# EAGLE design A32_to_Samtec50mil (EAGLE 8.6.1)
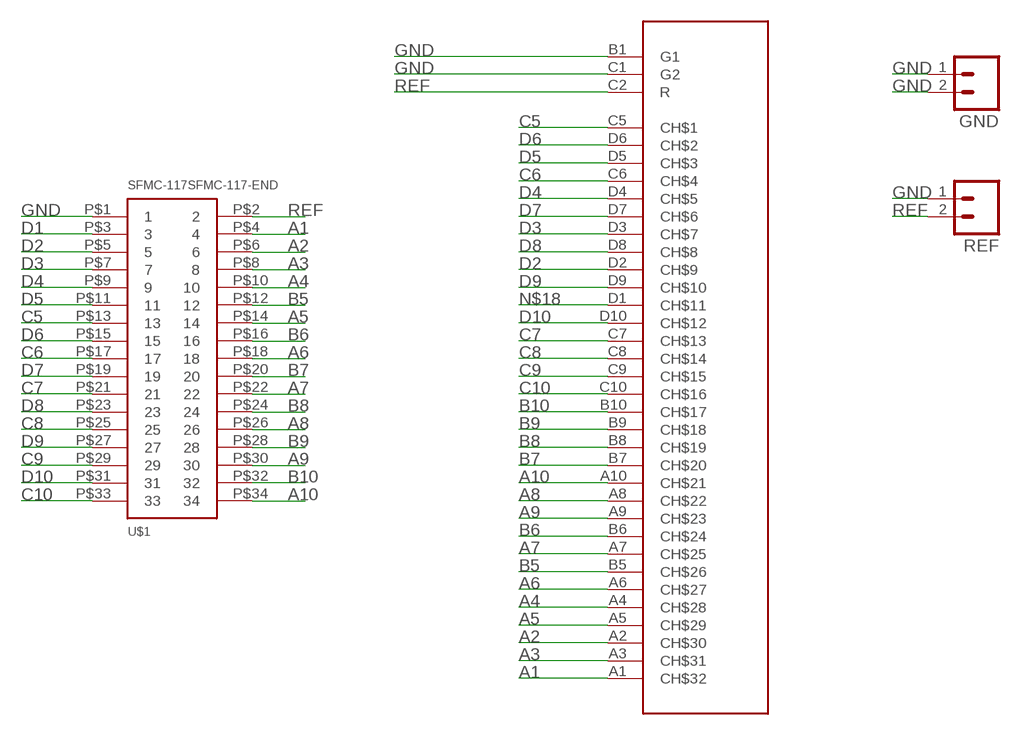
[diagram p0: schematic, sheet 1]

## Parts
GND  M02PTH  [1X02]
REF  M02PTH  [1X02]
U$1  SFMC-117SFMC-117-END  [SFMC-117-END]
U$2  NEURONEXUS-A32  [ROLC-110-XX-XX-Q-LC]

## Nets
A1: U$1.P$4 U$2.A1(CH$32)
A2: U$1.P$6 U$2.A2(CH$30)
A3: U$1.P$8 U$2.A3(CH$31)
A4: U$1.P$10 U$2.A4(CH$28)
A5: U$1.P$14 U$2.A5(CH$29)
A6: U$1.P$18 U$2.A6(CH$27)
A7: U$1.P$22 U$2.A7(CH$25)
A8: U$1.P$26 U$2.A8(CH$22)
A9: U$1.P$30 U$2.A9(CH$23)
A10: U$1.P$34 U$2.A10(CH$21)
B5: U$1.P$12 U$2.B5(CH$26)
B6: U$1.P$16 U$2.B6(CH$24)
B7: U$1.P$20 U$2.B7(CH$20)
B8: U$1.P$24 U$2.B8(CH$19)
B9: U$1.P$28 U$2.B9(CH$18)
B10: U$1.P$32 U$2.B10(CH$17)
C5: U$1.P$13 U$2.C5(CH$1)
C6: U$1.P$17 U$2.C6(CH$4)
C7: U$1.P$21 U$2.C7(CH$13)
C8: U$1.P$25 U$2.C8(CH$14)
C9: U$1.P$29 U$2.C9(CH$15)
C10: U$1.P$33 U$2.C10(CH$16)
D1: U$1.P$3
D2: U$1.P$5 U$2.D2(CH$9)
D3: U$1.P$7 U$2.D3(CH$7)
D4: U$1.P$9 U$2.D4(CH$5)
D5: U$1.P$11 U$2.D5(CH$3)
D6: U$1.P$15 U$2.D6(CH$2)
D7: U$1.P$19 U$2.D7(CH$6)
D8: U$1.P$23 U$2.D8(CH$8)
D9: U$1.P$27 U$2.D9(CH$10)
D10: U$1.P$31 U$2.D10(CH$12)
GND: GND.1 GND.2 REF.1 U$1.P$1 U$2.B1(G1) U$2.C1(G2)
N$18: U$2.D1(CH$11)
REF: REF.2 U$1.P$2 U$2.C2(R)

## Library data of the parts
GND REF = SparkFun:M02: Header 2 Standard 2-pin 0.1" header. Use with straight break away headers (SKU : PRT-00116), right angle break away headers (PRT-00553), swiss pins (PRT-00743), machine pins (PRT-00117), and female headers (PRT-00115). Molex polarized connector foot print use with SKU : PRT-08233 with associated crimp pins and housings.
U$1 = UsefulConnectors:SFMC-117
U$2 = UsefulConnectors:NEURONEXUS-A32

## Board
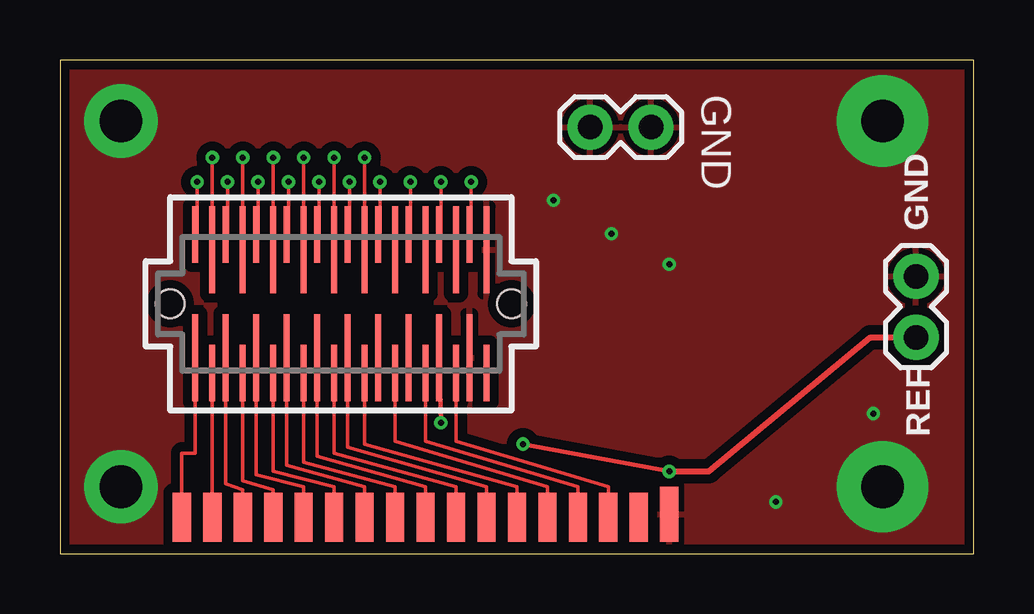
[diagram p1: board, top side]
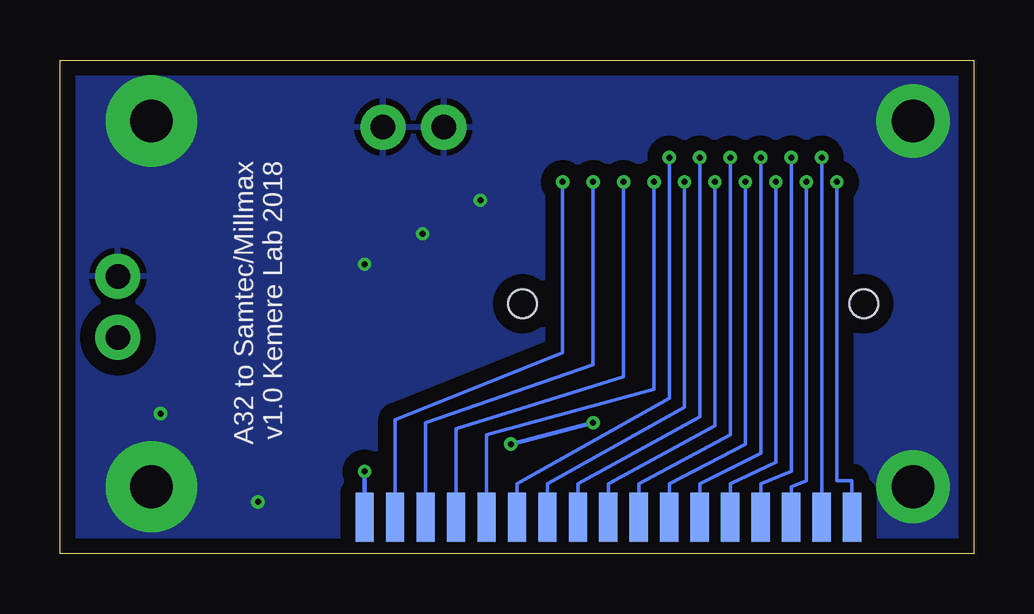
[diagram p2: board, bottom side, seen from below]

Size 38.1 x 20.57 mm. Coordinates in mm from the lower left corner, seen from the top.
Outline: 0,0 38.1,0 38.1,20.57 0,20.57 0,0
Copper layers (1*16): Top 0.035mm / dielectric 1.5mm / Bottom 0.035mm
Design rules "default *": minimum track width 5mil, minimum drill 0.25mm, track to track 5mil, track to pad 5mil, pad to pad 5mil, via to via 11mil, smd to smd 5mil, copper to edge 0.3mm, drill to drill 12mil, minimum pad ring 6mil, minimum via ring 6mil, stop-mask expansion 4mil, vias tented up to drill 0mil, thermal gap 10mil

### Footprints (pad centres in the part's own frame; a part is rotated, then mirrored left to right if it is on the bottom)
1X02 = drill 1.016 pad 1.88: 1 0,0; 2 2.54,0
SFMC-117-END = smd 0.762 x 2.286: P$1 -10.16,-0.127 | smd 0.762 x 2.032 bottom: P$2 -10.16,0; P$4 -8.89,0; P$6 -7.62,0; P$8 -6.35,0; P$10 -5.08,0; P$12 -3.81,0; P$14 -2.54,0; P$16 -1.27,0; P$18 0,0; P$20 1.27,0; P$22 2.54,0; P$24 3.81,0; P$26 5.08,0; P$28 6.35,0; P$30 7.62,0; P$32 8.89,0; P$34 10.16,0 | smd 0.762 x 2.032: P$3 -8.89,0; P$5 -7.62,0; P$7 -6.35,0; P$9 -5.08,0; P$11 -3.81,0; P$13 -2.54,0; P$15 -1.27,0; P$17 0,0; P$19 1.27,0; P$21 2.54,0; P$23 3.81,0; P$25 5.08,0; P$27 6.35,0; P$29 7.62,0; P$31 8.89,0; P$33 10.16,0
ROLC-110-XX-XX-Q-LC = smd 0.254 x 2.362: A1 5.639,2.883; A2 4.369,2.883; A3 3.099,2.883; A4 1.829,2.883; A5 0.559,2.883; A6 -0.711,2.883; A7 -1.981,2.883; A8 -3.251,2.883; A9 -4.521,2.883; A10 -5.791,2.883; D1 6.35,-2.883; D2 5.08,-2.883; D3 3.81,-2.883; D4 2.54,-2.883; D5 1.27,-2.883; D6 0,-2.883; D7 -1.27,-2.883; D8 -2.54,-2.883; D9 -3.81,-2.883; D10 -5.08,-2.883 | smd 0.254 x 3.632: B1 6.35,2.248; B2 5.08,2.248; B3 3.81,2.248; B4 2.54,2.248; B5 1.27,2.248; B6 0,2.248; B7 -1.27,2.248; B8 -2.54,2.248; B9 -3.81,2.248; B10 -5.08,2.248; C1 5.639,-2.248; C2 4.369,-2.248; C3 3.099,-2.248; C4 1.829,-2.248; C5 0.559,-2.248; C6 -0.711,-2.248; C7 -1.981,-2.248; C8 -3.251,-2.248; C9 -4.521,-2.248; C10 -5.791,-2.248 | hole 1.194: 7.391,0; -6.833,0

### Placement (x,y rotation side)
GND  22.1,17.78 0 top
REF  35.69,11.56 270 top
U$1  15.24,1.52 180 top
U$2  11.43,10.41 0 top

### Tracks (layer width: path | path; a pad name or v marks a point on that pad's centre or on a via)
A1  (via drill 0.25)
  Top 0.152: v17.14,15.49 17.14,13.3 U$2.A1
  Bottom 0.152: U$1.P$4 24.13,5.59 17.14,8.38 v17.14,15.49
A2  (via drill 0.25)
  Top 0.152: v15.88,15.49 15.88,13.3 U$2.A2
  Bottom 0.152: U$1.P$6 22.86,5.46 15.88,7.87 v15.88,15.49
A3  (via drill 0.25)
  Top 0.152: v14.61,15.49 14.61,13.3 U$2.A3
  Bottom 0.152: U$1.P$8 21.59,5.21 14.61,7.37 v14.61,15.49
A4  (via drill 0.25)
  Top 0.152: v13.34,15.49 13.34,13.3 U$2.A4
  Bottom 0.152: U$1.P$10 20.32,4.95 13.34,6.86 v13.34,15.49
A5  (via drill 0.25)
  Top 0.152: v12.06,15.49 12.06,13.3 U$2.A5
  Bottom 0.152: U$1.P$14 17.78,2.92 12.06,6.1 v12.06,15.49
A6  (via drill 0.25)
  Top 0.152: v10.79,15.49 10.79,13.3 U$2.A6
  Bottom 0.152: U$1.P$18 15.24,2.92 10.79,5.33 v10.79,15.49
A7  (via drill 0.25)
  Top 0.152: v9.53,15.49 9.53,13.3 U$2.A7
  Bottom 0.152: U$1.P$22 12.7,2.92 9.53,4.57 v9.53,15.49
A8  (via drill 0.25)
  Top 0.152: v8.26,15.49 8.26,13.3 U$2.A8
  Bottom 0.152: U$1.P$26 10.16,2.92 8.26,3.81 v8.26,15.49
A9  (via drill 0.25)
  Top 0.152: v6.99,15.49 6.99,13.3 U$2.A9
  Bottom 0.152: U$1.P$30 7.62,2.79 6.99,3.05 v6.99,15.49
A10  (via drill 0.25)
  Top 0.152: v5.71,15.49 5.71,13.3 U$2.A10
  Bottom 0.152: U$1.P$34 5.08,3.05 5.71,3.05 v5.71,15.49
B5  (via drill 0.25)
  Top 0.152: v12.7,16.51 U$2.B5
  Bottom 0.152: U$1.P$12 19.05,2.92 12.7,6.48 v12.7,16.51
B6  (via drill 0.25)
  Top 0.152: v11.43,16.51 U$2.B6
  Bottom 0.152: U$1.P$16 16.51,2.92 11.43,5.71 v11.43,16.51
B7  (via drill 0.25)
  Top 0.152: v10.16,16.51 U$2.B7
  Bottom 0.152: U$1.P$20 13.97,2.92 10.16,4.95 v10.16,16.51
B8  (via drill 0.25)
  Top 0.152: v8.89,16.51 U$2.B8
  Bottom 0.152: U$1.P$24 11.43,2.92 8.89,4.19 v8.89,16.51
B9  (via drill 0.25)
  Top 0.152: U$2.B9 v7.62,16.51
  Bottom 0.152: v7.62,16.51 7.62,3.43 8.89,2.92 U$1.P$28
B10  (via drill 0.25)
  Top 0.152: v6.35,16.51 U$2.B10
  Bottom 0.152: U$1.P$32 v6.35,16.51
C5
  Top 0.152: U$2.C5 11.99,4.45 17.78,2.79 U$1.P$13
C6
  Top 0.152: U$2.C6 10.72,4.06 15.24,2.79 U$1.P$17
C7
  Top 0.152: U$2.C7 9.45,3.68 12.7,2.79 U$1.P$21
C8
  Top 0.152: U$2.C8 8.18,3.3 10.16,2.79 U$1.P$25
C9
  Top 0.152: U$1.P$29 7.62,2.67 6.91,2.92 U$2.C9
C10
  Top 0.152: U$2.C10 5.64,4.19 5.08,4.19 U$1.P$33
D2
  Top 0.152: U$2.D2 16.51,4.7 22.86,2.79 U$1.P$5
D3
  Top 0.152: U$2.D3 15.24,4.7 21.59,2.79 U$1.P$7
D4
  Top 0.152: U$2.D4 13.97,4.7 20.32,2.79 U$1.P$9
D5
  Top 0.152: U$2.D5 12.7,4.57 19.05,2.79 U$1.P$11
D6
  Top 0.152: U$2.D6 11.43,4.19 16.51,2.79 U$1.P$15
D7
  Top 0.152: U$2.D7 10.16,3.81 13.97,2.79 U$1.P$19
D8
  Top 0.152: U$2.D8 8.89,3.43 11.43,2.79 U$1.P$23
D9
  Top 0.152: U$2.D9 7.62,3.05 8.89,2.67 U$1.P$27
D10
  Top 0.152: U$1.P$31 U$2.D10
GND  (via drill 0.25, 1.78 pad 3.05, 1.78 pad 3.81)
  Top 0.254: U$2.B1 17.78,11.43
  other vias: 2.54,18.03 2.54,2.79 34.29,18.03 34.29,2.79 25.4,12.06 22.99,13.34 20.57,14.73 29.84,2.16 33.91,5.84
  pour Top (isolate 0.381): 0,0 0,20.57 38.1,20.57 38.1,0
  pour Bottom (isolate 0.635): 0,0 0,20.57 38.1,20.57 38.1,0
REF  (via drill 0.25)
  Top 0.178: v25.4,3.43 v19.3,4.57 | v15.88,5.46 U$2.C2
  Top 0.254: v25.4,3.43 27.05,3.43 33.78,9.02 REF.2
  Bottom 0.178: U$1.P$2 v25.4,3.43 | v19.3,4.57 v15.88,5.46

### Text on the board
tPlace: GND
bPlace: A32 to Samtec/Millmax / v1.0 Kemere Lab 2018